# Altium schematic sheet Radio Module scheme.SchDoc
size A4
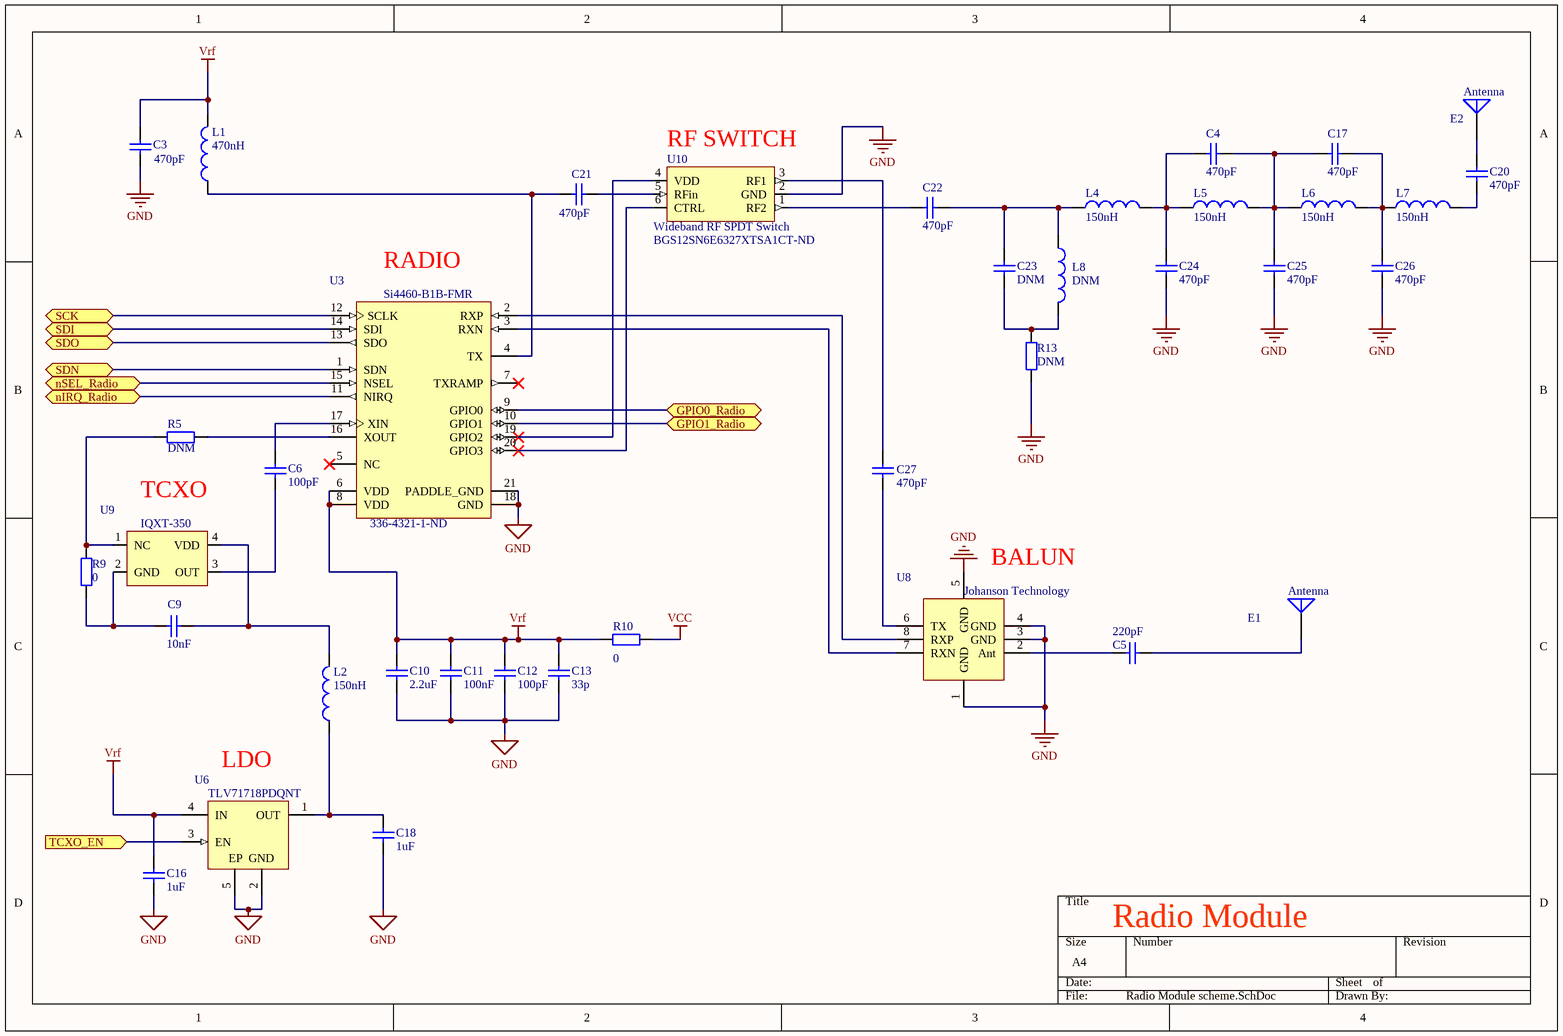
[diagram p0: Radio Module scheme.SchDoc]

## Parts
C3  value 470pF  [0402_CAP]  (hidden comment: Cap Semi)
C4  value 470pF  [0402_CAP]  (hidden comment: Cap Semi)
C5  value 220pF  [0402_CAP]  (hidden comment: Cap Semi)
C6  value 100pF  [0402_CAP]  (hidden comment: Cap Semi)
C9  value 10nF  [0402_CAP]  (hidden comment: Cap Semi)
C10  value 2.2uF  [0402_CAP]  (hidden comment: Cap Semi)
C11  value 100nF  [0402_CAP]  (hidden comment: Cap Semi)
C12  value 100pF  [0402_CAP]  (hidden comment: Cap Semi)
C13  value 33p  [0402_CAP]  (hidden comment: Cap Semi)
C16  value 1uF  [0402_CAP]  (hidden comment: Cap Semi)
C17  value 470pF  [0402_CAP]  (hidden comment: Cap Semi)
C18  value 1uF  [0402_CAP]  (hidden comment: Cap Semi)
C20  value 470pF  [0402_CAP]  (hidden comment: Cap Semi)
C21  value 470pF  [0402_CAP]  (hidden comment: Cap Semi)
C22  value 470pF  [0402_CAP]  (hidden comment: Cap Semi)
C23  value DNM  [0402_CAP]  (hidden comment: Cap Semi)
C24  value 470pF  [0402_CAP]  (hidden comment: Cap Semi)
C25  value 470pF  [0402_CAP]  (hidden comment: Cap Semi)
C26  value 470pF  [0402_CAP]  (hidden comment: Cap Semi)
C27  value 470pF  [0402_CAP]  (hidden comment: Cap Semi)
E1  Antenna  [PIN1]
E2  Antenna  [PIN1]
L1  value 470nH  [0402-A]  (hidden comment: Inductor)
L2  value 150nH  [0402-A]  (hidden comment: Inductor)
L4  value 150nH  [0402-A]  (hidden comment: Inductor)
L5  value 150nH  [0402-A]  (hidden comment: Inductor)
L6  value 150nH  [0402-A]  (hidden comment: Inductor)
L7  value 150nH  [0402-A]  (hidden comment: Inductor)
L8  value DNM  [0402-A]  (hidden comment: Inductor)
R5  value DNM  [0402_RES]  (hidden comment: Res2)
R9  value 0  [0402_RES]  (hidden comment: Res2)
R10  value 0  [0402_RES]  (hidden comment: Res2)
R13  value DNM  [0402_RES]  (hidden comment: Res2)
U3  Si4460-B1B-FMR  Supplier Part Number 3: 336-4321-1-ND  [SLAB-QFN-20-2600x2600TP_N]
U6  TLV71718PDQNT  [TI-DQN4-480X480TP_V]
U8  Mfr 1: Johanson Technology  [Balun]  (hidden comment: Balun)
U9  IQXT-350  [IQXT-350]
U10  Wideband RF SPDT Switch  Supplier Part Number 1: BGS12SN6E6327XTSA1CT-ND  [LGA6C40P2X3_70X110X40]

## Ports
GPIO0_Radio, GPIO1_Radio, nIRQ_Radio, nSEL_Radio, SCK, SDI, SDN, SDO, TCXO_EN (in)

## Nets
GND: C3.2 C10.2 C11.2 C12.2 C13.2 C16.2 C18.2 C24.1 C25.1 C26.1 R13.1 U3.18(GND) U3.21(PADDLE_GND) U6.2(GND) U6.5(EP) U8.1(GND) U8.3(GND) U8.4(GND) U8.5(GND) U10.2(GND)
VCC: R10.2
Vrf: C3.1 C10.1 C11.1 C12.1 C13.1 C16.1 L1.2 R10.1 U3.6(VDD) U3.8(VDD) U6.4(IN)
GPIO0_Radio: U3.9(GPIO0) ; port GPIO0_Radio
GPIO1_Radio: U3.10(GPIO1) ; port GPIO1_Radio
nIRQ_Radio: U3.11(NIRQ) ; port nIRQ_Radio
nSEL_Radio: U3.15(NSEL) ; port nSEL_Radio
SCK: U3.12(SCLK) ; port SCK
SDI: U3.14(SDI) ; port SDI
SDN: U3.1(SDN) ; port SDN
SDO: U3.13(SDO) ; port SDO
TCXO_EN: U6.3(EN) ; port TCXO_EN
NetC4_1: C4.1 C24.2 L4.2 L5.1
NetC4_2: C4.2 C17.1 C25.2 L5.2 L6.1
NetC5_1: C5.1 E1.1(A)
NetC5_2: C5.2 U8.2(Ant)
NetC6_1: C6.1 U3.17(XIN)
NetC6_2: C6.2 U9.3(OUT)
NetC9_1: C9.1 R9.1 U9.2(GND)
NetC9_2: C9.2 L2.2 U9.4(VDD)
NetC17_2: C17.2 C26.2 L6.2 L7.1
NetC18_1: C18.1 L2.1 U6.1(OUT)
NetC20_1: C20.1 L7.2
NetC20_2: C20.2 E2.1(A)
NetC21_1: C21.1 U10.5(RFin)
NetC21_2: C21.2 L1.1 U3.4(TX)
NetC22_1: C22.1 C23.2 L4.1 L8.1
NetC22_2: C22.2 U10.1(RF2)
NetC23_1: C23.1 L8.2 R13.2
NetC27_1: C27.1 U8.6(TX)
NetC27_2: C27.2 U10.3(RF1)
NetR5_1: R5.1 R9.2 U9.1(NC)
NetR5_2: R5.2 U3.16(XOUT)
NetU3_2: U3.2(RXP) U8.8(RXP)
NetU3_3: U3.3(RXN) U8.7(RXN)
NetU3_19: U3.19(GPIO2) U10.4(VDD)
NetU3_20: U3.20(GPIO3) U10.6(CTRL)

Not connected (* = marked no-connect by the designer): U3 5(NC)* 7(TXRAMP)*

## Notes on the sheet
- (near U10) RF SWITCH
- (near U3) RADIO
- TCXO
- (near U8) BALUN
- (near U6) LDO
- Radio Module

## Library data of the parts
C3-C6 C9-C13 C16-C18 C20-C27 = Cap Semi: Capacitor (Semiconductor SIM Model); Published: 8-Jun-2000; LatestRevisionDate: 29-May-2009; LatestRevisionNote: IPC-7351 Footprint Added.; PackageReference: C1206; Publisher: Altium Limited; PackageDescription: Chip Capacitor
  C3-C5 C17 C20-C27: Supplier 1: Farnell; Supplier 2: Digi-Key
E1 E2 = Antenna: Generic Antenna; Published: 24-Mar-1999; LatestRevisionDate: 17-Jul-2002; LatestRevisionNote: Re-released for DXP Platform.; PackageReference: PIN1; Publisher: Altium Limited
L1 L2 L4-L8 = Inductor: Code_IEC: 1005; Published: 8-Jun-2000; LatestRevisionDate: 29-May-2009; LatestRevisionNote: IPC-7351 Footprint Added.; PackageReference: 0402-A; Publisher: Altium Limited; PackageDescription: Chip Inductor; Code_JEITA: 0402
  L2 L4-L8: Supplier 1: Digi-Key; Supplier Part Number 1: 445-9509-1-ND
R5 R9 R10 R13 = Res2: Resistor; Published: 8-Jun-2000; LatestRevisionDate: 17-Jul-2002; LatestRevisionNote: Re-released for DXP Platform.; PackageReference: AXIAL-0.4; Publisher: Altium Limited; PackageDescription: Axial Device, Thru-Hole; 2 Leads; 0.4 in Pin Spacing
  R9 R10 R13: Supplier 1: Digi-Key; Supplier Part Number 1: 311-0.0LBCT-ND
U3 = Si4460-B1B-FMR: High-Performance, Low-Current Transceiver, 142 to 1050 MHz, -40 to 13 dBm Output Power, -40 to 85 degC, 20-pin QFN, Tape and Reel; Manufacturer: Silicon Labs; FSK/GFSK: 1000 kbps; OOK: 120 kbps; RX Current: 10/13 mA; Sub-Family: EZRadioPRO; DatasheetVersion: Rev. 1.2; PackageReference: QFN-20; PackageDescription: 20-Pin Quad-Flat No-Leads Package, Body 4 x 4 mm, Pitch 0.5 mm; Supplier 1: Digi-Key; Supplier Part Number 1: SI4460-B1B-FMR-ND; Supplier 2: Mouser; Supplier Part Number 2: 634-SI4460-B1B-FMR; Frequency Range: 142 to 1050 MHz; Output Power Range: -40 to 13 dBm; Packing: Tape and Reel; Mounting Technology: Surface Mount; Code_JEDEC: MO-220; Code_IPC: J-STD-020C; PartNumber: Si4460-B1B-FMR; ComponentLink1Description: Manufacturer URL; ComponentLink1URL: http://www.silabs.com/; ComponentLink2Description: Datasheet; ComponentLink2URL: http://www.silabs.com/Support Documents/TechnicalDocs/Si4464-63-61-60.pdf; ComponentLink3Description: Package Specification; ComponentLink3URL: http://www.silabs.com/Support%20Documents/TechnicalDocs/Si4464-63-61-60.pdf; Supplier 3: Digi-Key
U6 = TLV71718PDQNT: Single Output Low Noise LDO, 150 mA, Fixed 1.8 V Output, 1.7 to 5.5 V Input, 4-pin X2SON (DQN), -40 to 85 degC, Green (RoHS & no Sb/Br); Manufacturer: Texas Instruments; Accuracy(%): 1.5; Fixed Output Options(V): 1.8; Iout(Max)(A): 0.15; Iq(Typ)(mA): 0.03; SubFamily: Single Channel LDO; Vdo(Typ)(mV): 360; Vin(Max)(V): 5.5; Vin(Min)(V): 1.7; DatasheetVersion: SBVS176A; PackageVersion: 4210367/D; PackageReference: DQN4-480X480TP; PackageDescription: 4-Pin Plastic Small Outline, Body 1 x 1 mm, Pitch 0.65 mm; Supplier 1: Digi-Key; Supplier 2: Digi-Key; Supplier Part Number 2: 296-30484-1-ND; Supplier 3: Digi-Key; Supplier Part Number 3: 296-30484-6-ND; Supplier 4: Farnell; Supplier Part Number 4: 2144274; Supplier 5: Newark; Supplier Part Number 5: 94T1806; Supplier 6: Newark; Supplier Part Number 6: 27W5374; Supplier 7: Mouser; Supplier Part Number 7: 595-TLV71718PDQNT; Eco-Plan: Green (RoHS & no Sb/Br); Vout Adj(Max)(V): 1.8; Vout Adj(Min)(V): 1.8; Mounting Technology: Surface Mount; PartNumber: TLV71718PDQNT; ComponentLink1Description: Manufacturer URL; ComponentLink1URL: http://www.ti.com/; ComponentLink2Description: Datasheet; ComponentLink2URL: http://www.ti.com/general/docs/lit/getliterature.tsp?genericPartNumber=TLV71718P&fileType=pdf
U8 = Balun: 433 MHz Impedance Matched Balun; Supplier 1: Digi-Key
U9 = TCXO: Temperature compensated Crystal oscillator; Supplier 1: Farnell
U10 = BGS12SN6: Supplier 1: Digi-Key